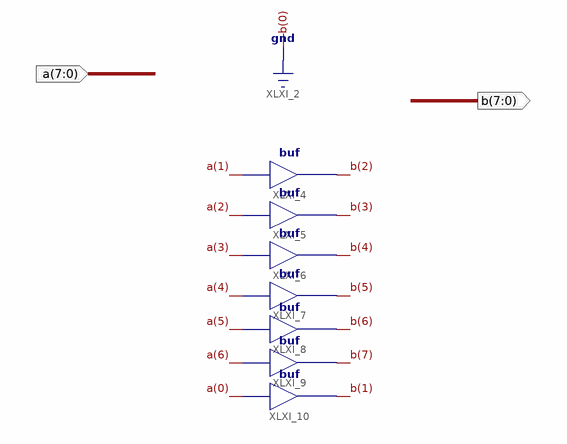
[diagram p0: schematic sheet 1]
// Xilinx ISE schematic shl.sch (spartan6) as structural Verilog: 7 symbols, 2 ports
module shl (
  input  [7:0] a,
  output [7:0] b
);

  buf XLXI_4 (b[2], a[1]);
  buf XLXI_5 (b[3], a[2]);
  buf XLXI_6 (b[4], a[3]);
  buf XLXI_7 (b[5], a[4]);
  buf XLXI_8 (b[6], a[5]);
  buf XLXI_9 (b[7], a[6]);
  buf XLXI_10 (b[1], a[0]);

  assign b[0] = 1'b0;
endmodule
